# Altium schematic sheet Fan_Relay.SchDoc
size A; SheetNumber: 8; SheetTotal: 8
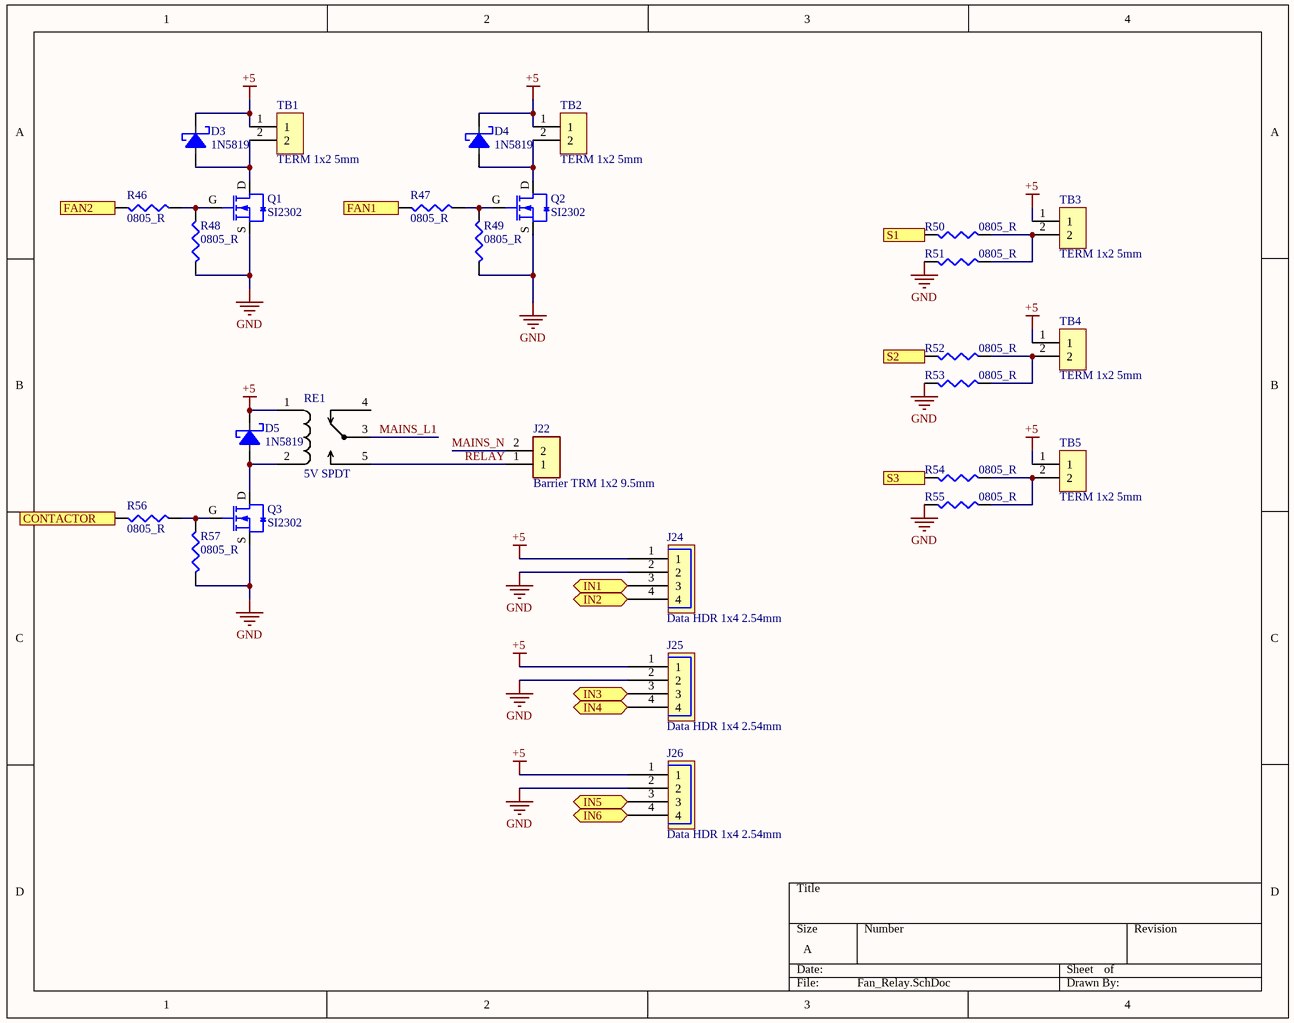
[diagram p0: Fan_Relay.SchDoc]

## Parts
D3  1N5819  [D0-214AC]
D4  1N5819  [D0-214AC]
D5  1N5819  [D0-214AC]
J22  Barrier TRM 1x2 9.5mm  [BARRIER_9.5MM]
J24  Data HDR 1x4 2.54mm  [DHDR_1x4_2.54mm]
J25  Data HDR 1x4 2.54mm  [DHDR_1x4_2.54mm]
J26  Data HDR 1x4 2.54mm  [DHDR_1x4_2.54mm]
Q1  SI2302  [SO-23 - MOSFET]
Q2  SI2302  [SO-23 - MOSFET]
Q3  SI2302  [SO-23 - MOSFET]
R46  0805_R  [R0805]
R47  0805_R  [R0805]
R48  0805_R  [R0805]
R49  0805_R  [R0805]
R50  0805_R  [R0805]
R51  0805_R  [R0805]
R52  0805_R  [R0805]
R53  0805_R  [R0805]
R54  0805_R  [R0805]
R55  0805_R  [R0805]
R56  0805_R  [R0805]
R57  0805_R  [R0805]
RE1  5V SPDT  [12mm_relay_spdt]
TB1  TERM 1x2 5mm  [Terminal_5mm]
TB2  TERM 1x2 5mm  [Terminal_5mm]
TB3  TERM 1x2 5mm  [Terminal_5mm]
TB4  TERM 1x2 5mm  [Terminal_5mm]
TB5  TERM 1x2 5mm  [Terminal_5mm]

## Ports
CONTACTOR (in), FAN1 (in), FAN2 (in), IN1 (bidir), IN2 (bidir), IN3 (bidir), IN4 (bidir), IN5 (bidir), IN6 (bidir), S1 (in), S2 (in), S3 (in)

## Nets
+5: D3.K(Cathode) D4.K(Cathode) D5.K(Cathode) J24.1 J25.1 J26.1 RE1.1 TB1.1 TB2.1 TB3.1 TB4.1 TB5.1
GND: J24.2 J25.2 J26.2 Q1.S Q2.S Q3.S R48.1 R49.1 R51.2 R53.2 R55.2 R57.1
CONTACTOR: R56.1 ; port CONTACTOR
FAN1: R47.1 ; port FAN1
FAN2: R46.1 ; port FAN2
IN1: J24.3 ; port IN1
IN2: J24.4 ; port IN2
IN3: J25.3 ; port IN3
IN4: J25.4 ; port IN4
IN5: J26.3 ; port IN5
IN6: J26.4 ; port IN6
MAINS_L1: RE1.3
MAINS_N: J22.2
RELAY: J22.1 RE1.5
S1: R50.2 ; port S1
S2: R52.2 ; port S2
S3: R54.2 ; port S3
NetD3_A: D3.A(Anode) Q1.D TB1.2
NetD4_A: D4.A(Anode) Q2.D TB2.2
NetD5_A: D5.A(Anode) Q3.D RE1.2
NetQ1_G: Q1.G R46.2 R48.2
NetQ2_G: Q2.G R47.2 R49.2
NetQ3_G: Q3.G R56.2 R57.2
NetR50_1: R50.1 R51.1 TB3.2
NetR52_1: R52.1 R53.1 TB4.2
NetR54_1: R54.1 R55.1 TB5.2

Not connected (* = marked no-connect by the designer): RE1 4

## Library data of the parts
D3-D5 = 1N5819: 1N5819 SS14 SMA Schottky Barrier Diodes (SBD) 40V 550mV@1A 1A
J22 = Barrier BLK: CONN BARRIER STRIP 2CIRC 0.374"; Manufacturer 1: On-Shore Technology; Manufacturer Part Number 1: OSTYK44102030; Current Rating: 30A; Voltage Rating: 300V; Parameter Name 1: Bulk; Number of Circuits: 2; Wire Gauge (Max): 22AWG; Wire Gauge (Min): 10AWG; Pitch: 0.374inch; Supplier 1: Digi-Key; Stock 1: 3505; Pricing 1: 1=1.22000, 10=0.76100, 25=0.65160, 50=0.58560, 100=0.57340, 250=0.48800, 500=0.46360, 1000=0.41480, 5000=0.32452 (USD); RoHS: Yes; Mount: Through Hole; Color: Black; Insulation Material: Nylon; Min Operating Temperature: -40°C; Max Operating Temperature: 105°C; Number of Rows: 1; Number of Wire Entries: 2; Flammability Rating: UL94 V-0; ComponentLink1URL: https://datasheet.ciiva.com/778/ostyk441xx030-778584.pdf?src-supplier=Digi-Key; ComponentLink1Description: https://datasheet.ciiva.com/778/ostyk441xx030-778584.pdf?src-supplier=Digi-Key; Supplier Part Number 1: ED2971-ND
J24-J26 = 4-Pin Data Connector: MTA-100 Series, 2.54mm Pitch 4 Way 1 RowStraight PCB Header, Solder Term, 5A; Manufacturer 1: TE Connectivity; Manufacturer Part Number 1: 2-644861-4; Underplate Material: Nickel; Number of Contacts: 4; Connector Type: Plug,Header,Pin; Voltage Rating: 250V; Gender: Male; Shrouded: Yes (With); PCB Mount Retention: Without; PCB Mounting Orientation: Vertical; Contact Resistance: 6mR; Backwall/Post Interruptions: No (Without); Connector System: Wire-to-Board; Contact Post Length: 3.56mm; Plating Thickness: 6.35um; PCB Thickness: 0.063inch; Approvals: CSA; Supplier 1: Digi-Key; Stock 1: 18767; Pricing 1: 1=0.79000, 10=0.74100, 100=0.56790, 500=0.49380, 1000=0.40739, 5000=0.35801, 10000=0.33332 (USD); RoHS: Yes; Mount: Through Hole; Housing Color: Black; Color: Black; Contact Material: Copper Alloy; Contact Plating: Tin,Matte; Housing Material: Polyester; Contact Shape: Square; Min Operating Temperature: -67°C; Max Operating Temperature: 221°C; Termination: Solder; Number of Rows: 1; Contact Gender: Male; Number of Positions: 4; Package Quantity: 500; Packaging: Loose Piece; Current Rating: 5A; Voltage Rating (AC): 250V; Mating Alignment: Yes (With); Orientation: Straight; Fastening Type: Friction; Max Voltage Rating (AC): 250V; Contact Current Rating: 5A; Contact Retention: No (Without); Mating Retention: Yes (With); PCB Mount Alignment: No (Without); Sealable: No (Without); Strain Relief: No (Without); Contact Style: Straight; Length: 12.29mm; Height: 10.41mm; Pitch: 2.54mm; Contact Mating Length: 5.1mm; Depth: 7.95mm; Tail Length: 3.56mm; Radiation Hardening: No; Flammability Rating: UL94 V-0; ELV: Compliant; Lead Free: Lead Free; REACH SVHC: Unknown; ComponentLink1URL: https://datasheet.ciiva.com/7800/1651878-7800290.pdf?src-supplier=Element14; ComponentLink1Description: https://datasheet.ciiva.com/7800/1651878-7800290.pdf?src-supplier=Element14; ComponentLink2URL: https://datasheet.ciiva.com/15175/getdatasheetpartid-36841-15175492.pdf?src-supplier=Verical; ComponentLink2Description: https://datasheet.ciiva.com/15175/getdatasheetpartid-36841-15175492.pdf?src-supplier=Verical; ComponentLink3URL: https://datasheet.ciiva.com/11759/0900766b80f915a0-11759930.pdf?src-supplier=RSComponents; ComponentLink3Description: https://datasheet.ciiva.com/11759/0900766b80f915a0-11759930.pdf?src-supplier=RSComponents; ComponentLink4URL: https://datasheet.ciiva.com/714/eng-cd-644861-n-basefilename-714593.pdf?src-supplier=Digi-Key; ComponentLink4Description: https://datasheet.ciiva.com/714/eng-cd-644861-n-basefilename-714593.pdf?src-supplier=Digi-Key; ComponentLink5URL: https://datasheet.ciiva.com/16684/eng-ds-82056-mta-0608-16684709.pdf?src-supplier=Avnet+Europe; ComponentLink5Description: https://datasheet.ciiva.com/16684/eng-ds-82056-mta-0608-16684709.pdf?src-supplier=Avnet+Europe; ComponentLink6URL: https://datasheet.ciiva.com/16497/eng-ds-82056-mta-0608-16497871.pdf?src-supplier=Avnet+Asia; ComponentLink6Description: https://datasheet.ciiva.com/16497/eng-ds-82056-mta-0608-16497871.pdf?src-supplier=Avnet+Asia; Supplier Part Number 1: A30933-ND
Q1-Q3 = SI2302: SI2302 A2SHB 20V 2.5A 0.9W 40mΩ@4.5V,2.5A N Channel SOT-23 MOSFET SMD
R46-R57 = 0805 Resistor
RE1 = 5V Relay
TB1-TB5 = Terminal BLK Green: PHOENIX CONTACT         MKDSN 1,5/ 2             Wire-To-Board Terminal Block, 5 mm, 2 Ways, 26 AWG, 16 AWG, 1.5 mm, Screw; Manufacturer Part Number 1: 1729018; Parameter Name 1: Bulk; Number of Positions: 2; Current Rating: 13.5A; Number of Levels: 1; Current: 10A; Gender: Male; Voltage Rating: 400V; Voltage: 300V; Max Supply Voltage: 250V; Wire Gauge (Max): 26AWG; Stripping Length: 6mm; Approvals: UL,CSA,cULus,CB; Supplier 1: Mouser; Manufacturer 1: Phoenix Contact; Stock 1: 6371; Pricing 1: 1=1.10000, 10=1.05000, 50=1.01000, 100=0.97400, 250=0.91000, 500=0.83800 (USD); RoHS: Yes; Mount: Through Hole; Number of Pins: 2; Weight: 0.06949oz; Color: Green; Material: Polyamide; Housing Material: Polyamide; Housing Color: Green; Contact Material: Tin; Insulation Material: Nylon; Package Quantity: 50; Termination: Screw; Number of Positions Per Level: 2; Number of Contacts: 2; Number of Circuits: 2; Connector Type: Screw; Orientation: Straight; Number of Rows: 1; Max Current Rating: 13.5A; Number of Poles: 2; Length: 8.1mm; Height: 13.5mm; Pitch: 5mm; Wire Gauge (Min): 26AWG; Depth: 8.1mm; Width: 13.5mm; Wire/Cable Gauge: 26AWG; Radiation Hardening: No; REACH SVHC: Unknown; Flammability Rating: UL94 V-0; Lead Free: Lead Free; ComponentLink1URL: https://datasheet.ciiva.com/16071/1729018-16071814.pdf?src-supplier=Onlinecomponents.com; ComponentLink1Description: https://datasheet.ciiva.com/16071/1729018-16071814.pdf?src-supplier=Onlinecomponents.com; ComponentLink2URL: https://datasheet.ciiva.com/832/1729018-832055.pdf?src-supplier=Digi-Key; ComponentLink2Description: https://datasheet.ciiva.com/832/1729018-832055.pdf?src-supplier=Digi-Key; ComponentLink3URL: https://datasheet.ciiva.com/15169/getdatasheetpartid-177860-15169643.pdf?src-supplier=Verical; ComponentLink3Description: https://datasheet.ciiva.com/15169/getdatasheetpartid-177860-15169643.pdf?src-supplier=Verical; ComponentLink4URL: https://datasheet.ciiva.com/14607/70054375-14607356.pdf?src-supplier=Allied+Electronics; ComponentLink4Description: https://datasheet.ciiva.com/14607/70054375-14607356.pdf?src-supplier=Allied+Electronics; ComponentLink5URL: https://datasheet.ciiva.com/33105/1729018-33105978.pdf?src-supplier=Today+Components; ComponentLink5Description: https://datasheet.ciiva.com/33105/1729018-33105978.pdf?src-supplier=Today+Components; Supplier Part Number 1: 651-1729018